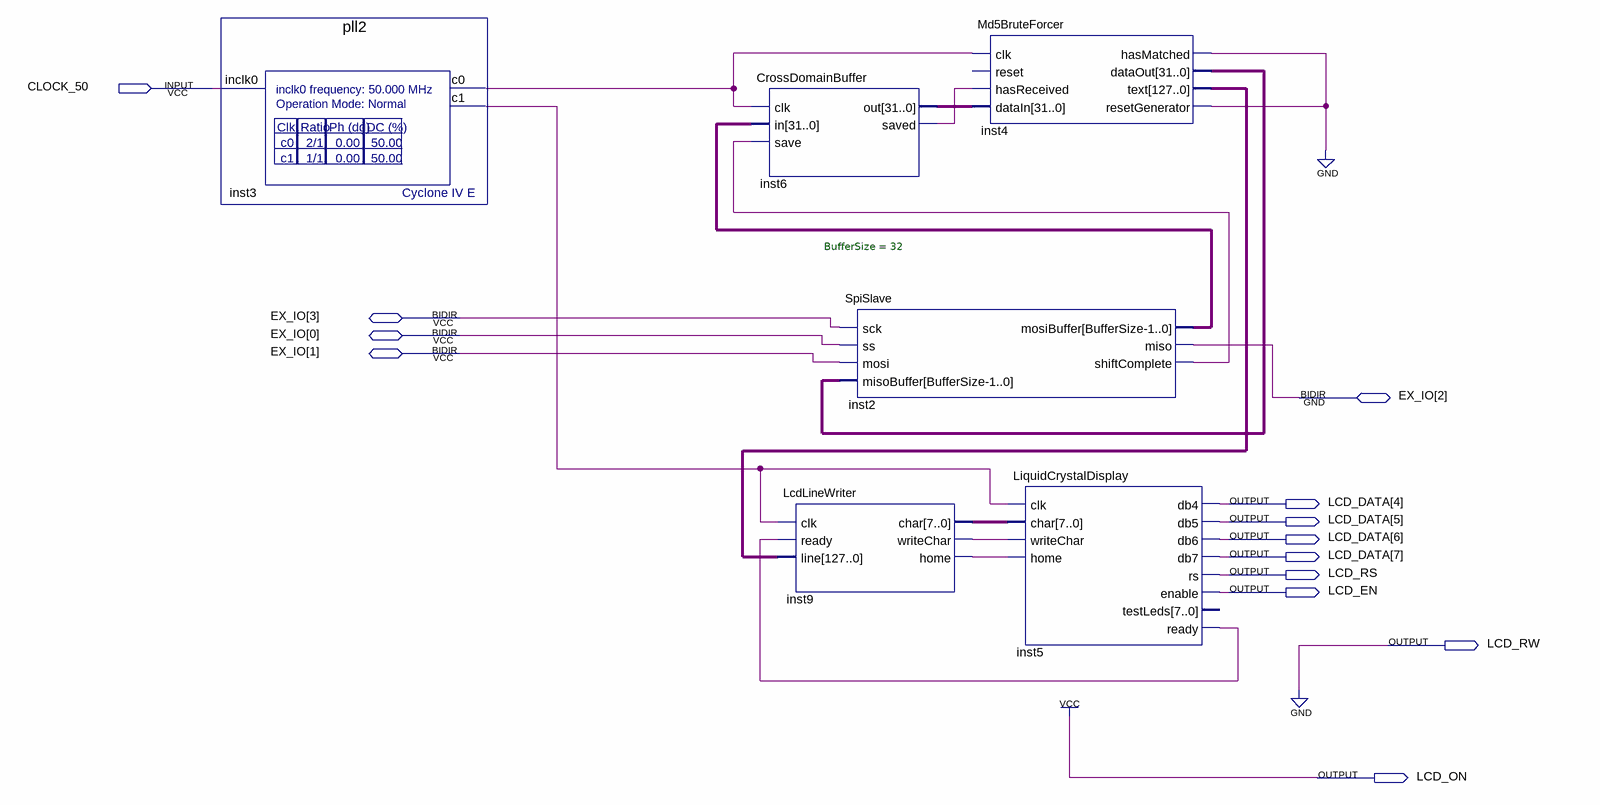
[diagram p0: schematic sheet]
// Quartus schematic Block3.bdf as structural Verilog: 6 symbols, 13 pins
module Block3 (
  input  CLOCK_50,
  inout  [3:0] EX_IO,
  output [7:4] LCD_DATA,
  output LCD_RS,
  output LCD_EN,
  output LCD_RW,
  output LCD_ON
);

  wire inst2_shiftcomplete, inst3_c0, inst3_c1, inst4_hasmatched, inst5_ready, inst6_saved, inst9_home,
       inst9_writechar;
  wire [7:0] inst9_char;
  wire [31:0] inst2_mosibuffer, inst4_dataout, inst6_out;
  wire [127:0] inst4_text;

  pll2 inst3 (.inclk0(CLOCK_50), .c0(inst3_c0), .c1(inst3_c1));
  CrossDomainBuffer inst6 (
    .clk(inst3_c0), .in(inst2_mosibuffer), .save(inst2_shiftcomplete), .out(inst6_out), .saved(inst6_saved));
  LcdLineWriter inst9 (
    .clk(inst3_c1), .ready(inst5_ready), .line(inst4_text), .char(inst9_char), .writeChar(inst9_writechar),
    .home(inst9_home));
  SpiSlave #(.BufferSize(32)) inst2 (
    .sck(EX_IO[3]), .ss(EX_IO[0]), .mosi(EX_IO[1]), .misoBuffer(inst4_dataout),
    .mosiBuffer(inst2_mosibuffer), .miso(EX_IO[2]), .shiftComplete(inst2_shiftcomplete));
  Md5BruteForcer inst4 (
    .clk(inst3_c0), .hasReceived(inst6_saved), .dataIn(inst6_out), .hasMatched(inst4_hasmatched),
    .dataOut(inst4_dataout), .text(inst4_text), .resetGenerator(inst4_hasmatched));  // open: reset
  LiquidCrystalDisplay inst5 (
    .clk(inst3_c1), .char(inst9_char), .writeChar(inst9_writechar), .home(inst9_home), .db4(LCD_DATA[4]),
    .db5(LCD_DATA[5]), .db6(LCD_DATA[6]), .db7(LCD_DATA[7]), .rs(LCD_RS), .enable(LCD_EN), .ready(inst5_ready));  // open: testLeds

  assign LCD_ON = 1'b1;
  assign LCD_RW = 1'b0;
  // also tied to GND on the sheet: inst4_hasmatched
endmodule
